# Altium schematic sheet 23 BUILD OPTION TABLES.SchDoc
size 513 x 386 mm
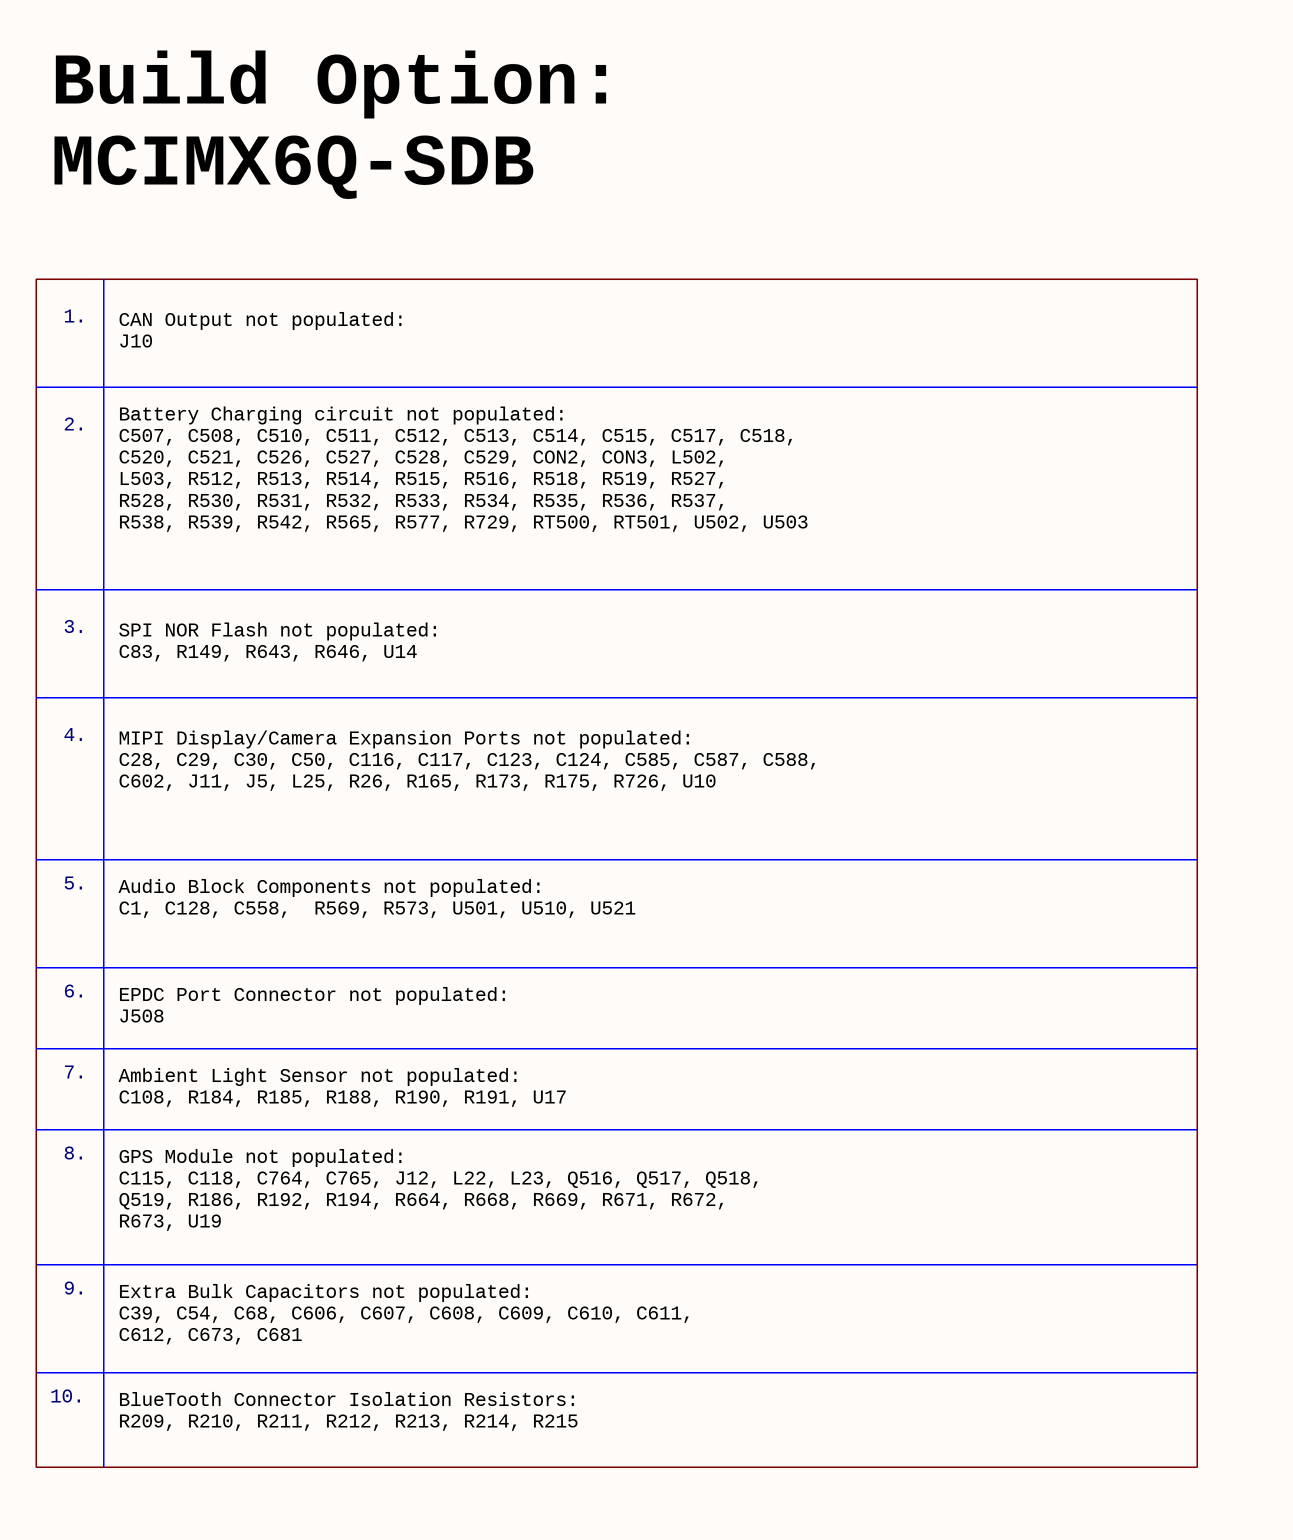
[diagram p0: 23 BUILD OPTION TABLES.SchDoc, left]
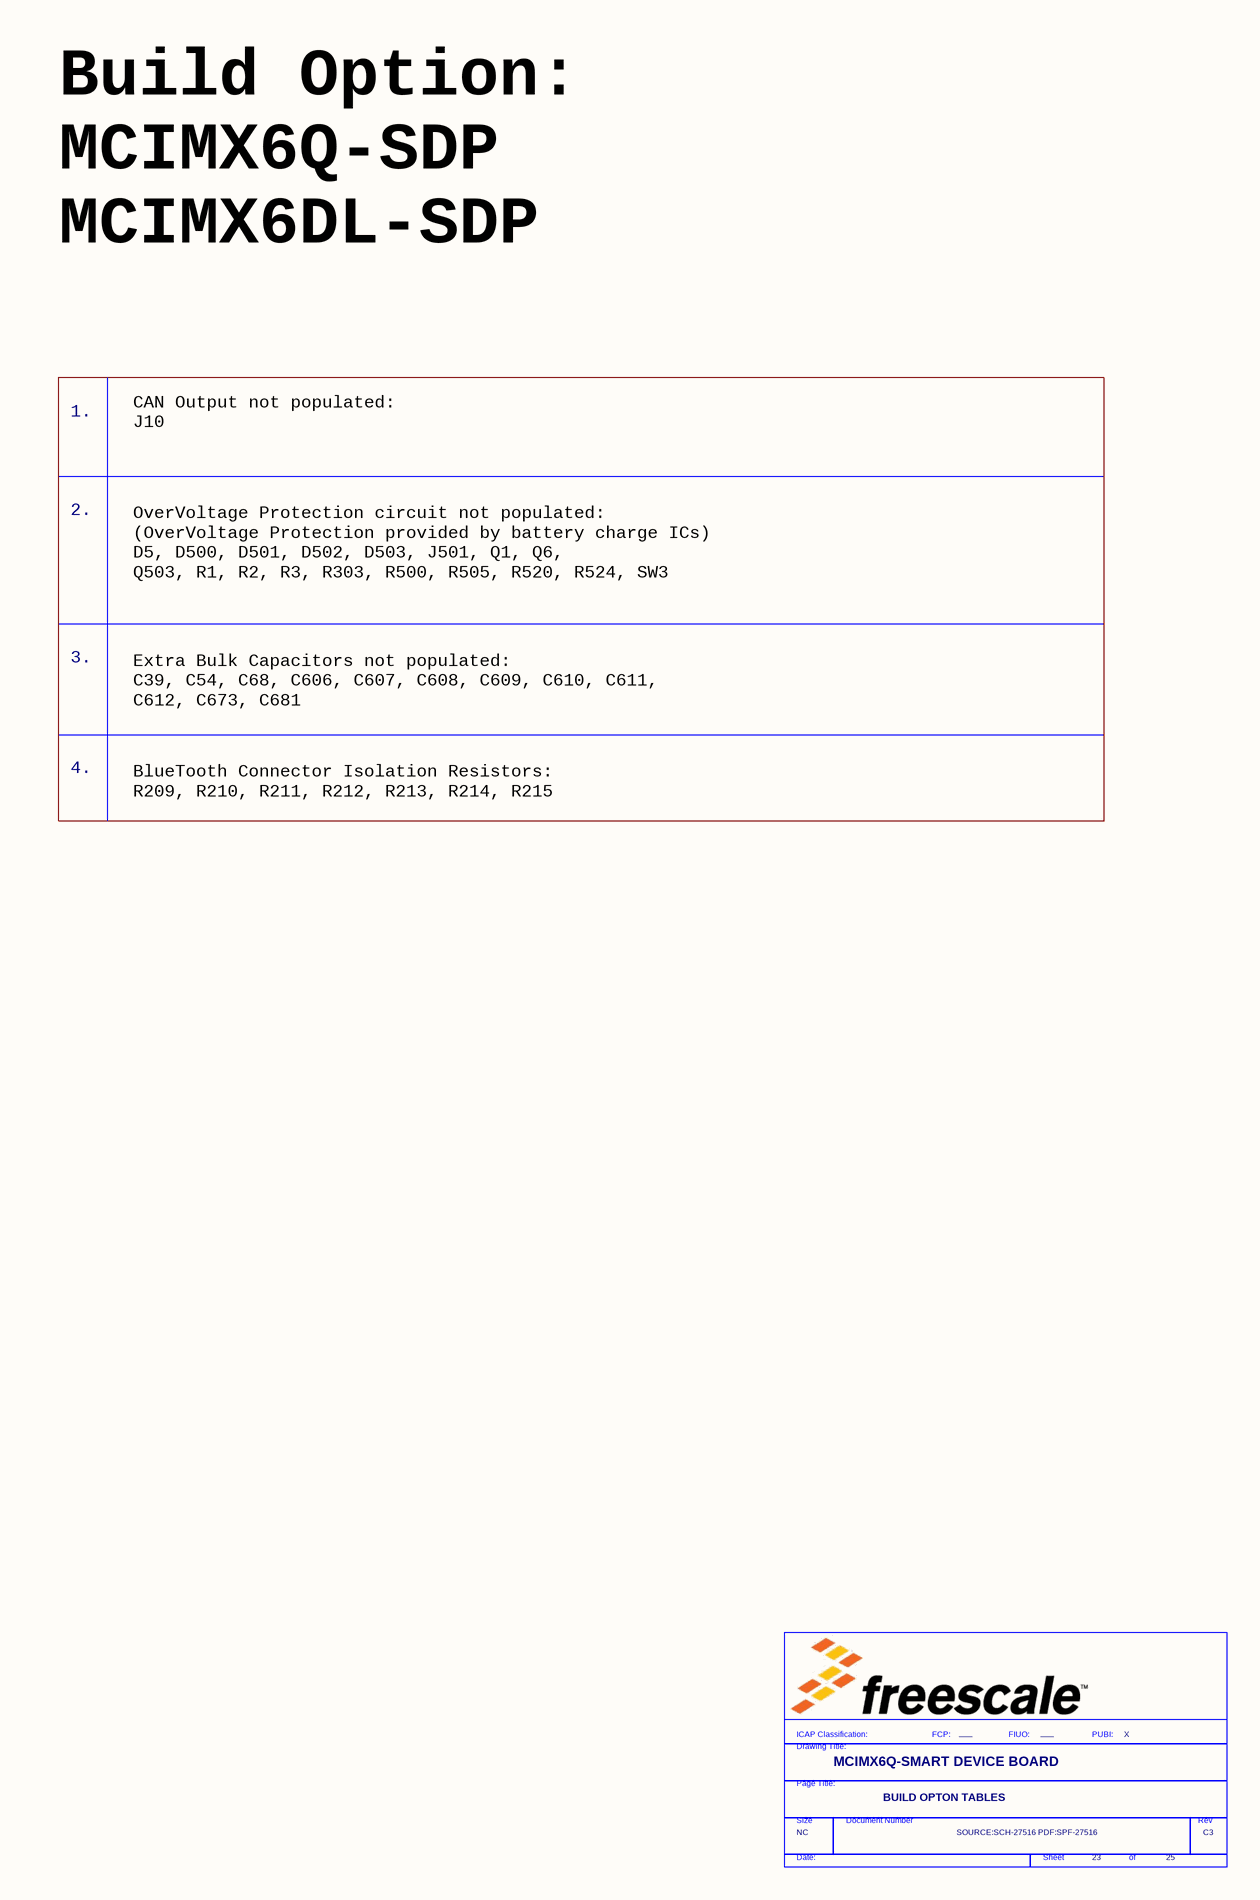
[diagram p1: 23 BUILD OPTION TABLES.SchDoc, right]

## Parts
*  FIUO: ___  PUBI: X  Doc: SOURCE:SCH-27516 PDF:SPF-27516  RevCode: C3  Title: MCIMX6Q-SMART DEVICE BOARD  Page Size: NC  Page Number: 23  Page Count: 25  PageTitle: BUILD OPTON TABLES  (hidden comment: TitleBlock_FS)  (graphical)

## Notes on the sheet
- Build Option:
  MCIMX6Q-SDB
- Build Option:
  MCIMX6Q-SDP
  MCIMX6DL-SDP
- 1.
- CAN Output not populated:
  J10
- Battery Charging circuit not populated:
  C507, C508, C510, C511, C512, C513, C514, C515, C517, C518,
  C520, C521, C526, C527, C528, C529, CON2, CON3, L502,
  L503, R512, R513, R514, R515, R516, R518, R519, R527,
  R528, R530, R531, R532, R533, R534, R535, R536, R537,
  R538, R539, R542, R565, R577, R729, RT500, RT501, U502, U503
- 2.
- OverVoltage Protection circuit not populated:
  (OverVoltage Protection provided by battery charge ICs)
  D5, D500, D501, D502, D503, J501, Q1, Q6,
  Q503, R1, R2, R3, R303, R500, R505, R520, R524, SW3
- 3.
- SPI NOR Flash not populated:
  C83, R149, R643, R646, U14
- MIPI Display/Camera Expansion Ports not populated:
  C28, C29, C30, C50, C116, C117, C123, C124, C585, C587, C588,
  C602, J11, J5, L25, R26, R165, R173, R175, R726, U10
- Extra Bulk Capacitors not populated:
  C39, C54, C68, C606, C607, C608, C609, C610, C611,
  C612, C673, C681
- 4.
- Audio Block Components not populated:
  C1, C128, C558,  R569, R573, U501, U510, U521
- BlueTooth Connector Isolation Resistors:
  R209, R210, R211, R212, R213, R214, R215
- 5.
- 6.
- EPDC Port Connector not populated:
  J508
- Ambient Light Sensor not populated:
  C108, R184, R185, R188, R190, R191, U17
- 7.
- GPS Module not populated:
  C115, C118, C764, C765, J12, L22, L23, Q516, Q517, Q518,
  Q519, R186, R192, R194, R664, R668, R669, R671, R672,
  R673, U19
- 8.
- 9.
- 10.
- (in symbol TitleBlock_FS) ICAP Classification:; FCP:; FIUO:; PUBI:; Drawing Title:; Page Title:; Size; Document Number; Rev; Date:; Sheet; of

## Library data of the parts
* = TitleBlock_FS: OrgAddr2: Austin, TX 78735-8598; OrgAddr1: 6501 William Cannon Drive West; OrgName: Freescale Semiconductor; FCP: ___; Page Create Date: March  8, 1995